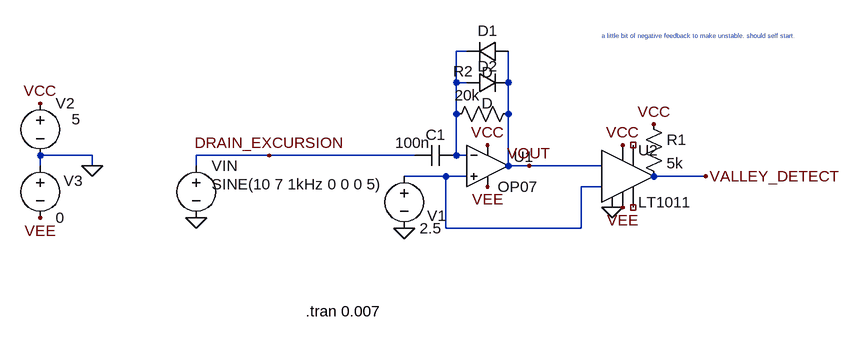
[diagram p0: schematic Draft8.asc]
Draft8.asc, the LTspice schematic file:
Version 4
SHEET 1 1208 680
WIRE 384 -80 368 -80
WIRE 368 -32 368 -80
WIRE 384 -32 368 -32
WIRE 448 -32 448 -80
WIRE 368 16 368 -32
WIRE 448 16 448 -32
WIRE -192 80 -272 80
WIRE 80 80 -32 80
WIRE 304 80 80 80
WIRE 368 80 368 16
WIRE 384 80 368 80
WIRE -272 96 -272 80
WIRE -192 96 -192 80
WIRE -32 96 -32 80
WIRE 448 96 448 16
WIRE 480 96 448 96
WIRE 592 96 480 96
WIRE 352 112 288 112
WIRE 384 112 352 112
WIRE 752 112 672 112
WIRE 592 128 560 128
WIRE 352 192 352 112
WIRE 560 192 560 128
WIRE 560 192 352 192
FLAG -32 176 0
FLAG -192 96 0
FLAG 480 96 VOUT
FLAG 288 192 0
FLAG -272 0 VCC
FLAG 416 64 VCC
FLAG -272 176 VEE
FLAG 416 128 VEE
FLAG 624 64 VCC
FLAG 624 160 VEE
FLAG 608 160 0
FLAG 672 32 VCC
FLAG 80 80 DRAIN_EXCURSION
FLAG 752 112 VALLEY_DETECT
SYMBOL voltage -32 80 R0
WINDOW 123 0 0 Left 0
WINDOW 39 0 0 Left 0
WINDOW 3 24 44 Left 2
SYMATTR Value SINE(10 7 1kHz 0 0 0 5)
SYMATTR InstName VIN
SYMBOL OpAmps\\OP07 416 32 R0
WINDOW 0 40 50 Left 2
SYMATTR InstName U1
SYMBOL voltage -272 -16 R0
WINDOW 123 0 0 Left 0
WINDOW 39 0 0 Left 0
WINDOW 3 48 40 Left 2
SYMATTR Value 5
SYMATTR InstName V2
SYMBOL voltage -272 80 R0
WINDOW 123 0 0 Left 0
WINDOW 39 0 0 Left 0
WINDOW 0 36 39 Left 2
SYMATTR InstName V3
SYMATTR Value 0
SYMBOL res 464 0 R90
WINDOW 0 -34 85 VBottom 2
WINDOW 3 -28 79 VTop 2
SYMATTR InstName R2
SYMATTR Value 20k
SYMBOL cap 368 64 R90
WINDOW 0 0 32 VBottom 2
WINDOW 3 -19 67 VTop 2
SYMATTR InstName C1
SYMATTR Value 100n
SYMBOL diode 448 -96 R90
WINDOW 0 0 32 VBottom 2
WINDOW 3 32 32 VTop 2
SYMATTR InstName D1
SYMBOL diode 384 -16 R270
WINDOW 0 26 32 VTop 2
WINDOW 3 0 32 VBottom 2
SYMATTR InstName D2
SYMBOL voltage 288 96 R0
WINDOW 0 35 77 Left 2
WINDOW 123 0 0 Left 0
WINDOW 39 0 0 Left 0
SYMATTR InstName V1
SYMATTR Value 2.5
SYMBOL Comparators\\LT1011 624 112 R0
SYMATTR InstName U2
SYMBOL res 656 16 R0
SYMATTR InstName R1
SYMATTR Value 5k
TEXT 136 320 Left 2 !.tran 0.007
TEXT 592 -104 Left 0 ;a little bit of negative feedback to make unstable. should self start.

The netlist it stands for:
* Draft8.asc
VIN DRAIN_EXCURSION 0 SINE(10 7 1kHz 0 0 0 5)
XU1 N002 N001 VCC VEE VOUT LT1001  ; OP07, pins In+ In- V+ V- OUT
V2 VCC 0 5
V3 0 VEE 0
R2 VOUT N001 20k
C1 N001 DRAIN_EXCURSION 100n
D1 VOUT N001 D
D2 N001 VOUT D
V1 N002 0 2.5
XU2 0 N002 VOUT VEE NC_01 NC_02 VALLEY_DETECT VCC LT1011
R1 VCC VALLEY_DETECT 5k
.model D D
.lib standard.dio
.tran 0.007
* a little bit of negative feedback to make unstable. should self start.
.lib LTC.lib
.lib LTC1.lib
.backanno
.end

* Results of the author's LTspice run, read from the files saved beside the schematic
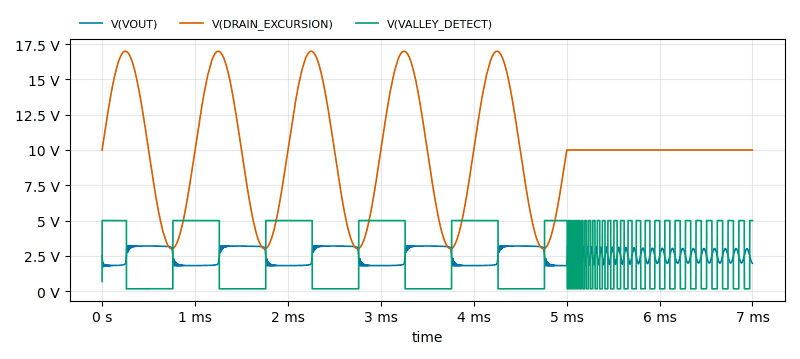
[diagram p1: Transient Analysis of Draft8.asc, plotted from the saved traces]
* Transient Analysis, 1 run:
*   V(VOUT): min 1.712 V, max 3.207 V, average 2.501 V, rms 2.571 V, last 1.973 V
*   V(DRAIN_EXCURSION): min 3 V, max 17 V, average 9.999 V, rms 10.84 V, last 10 V
*   V(VALLEY_DETECT): min 159.5 mV, max 5 V, average 2.58 V, rms 3.537 V, last 5 V